# Altium schematic sheet Power.SchDoc
size A4; SheetNumber: 4; SheetTotal: 11
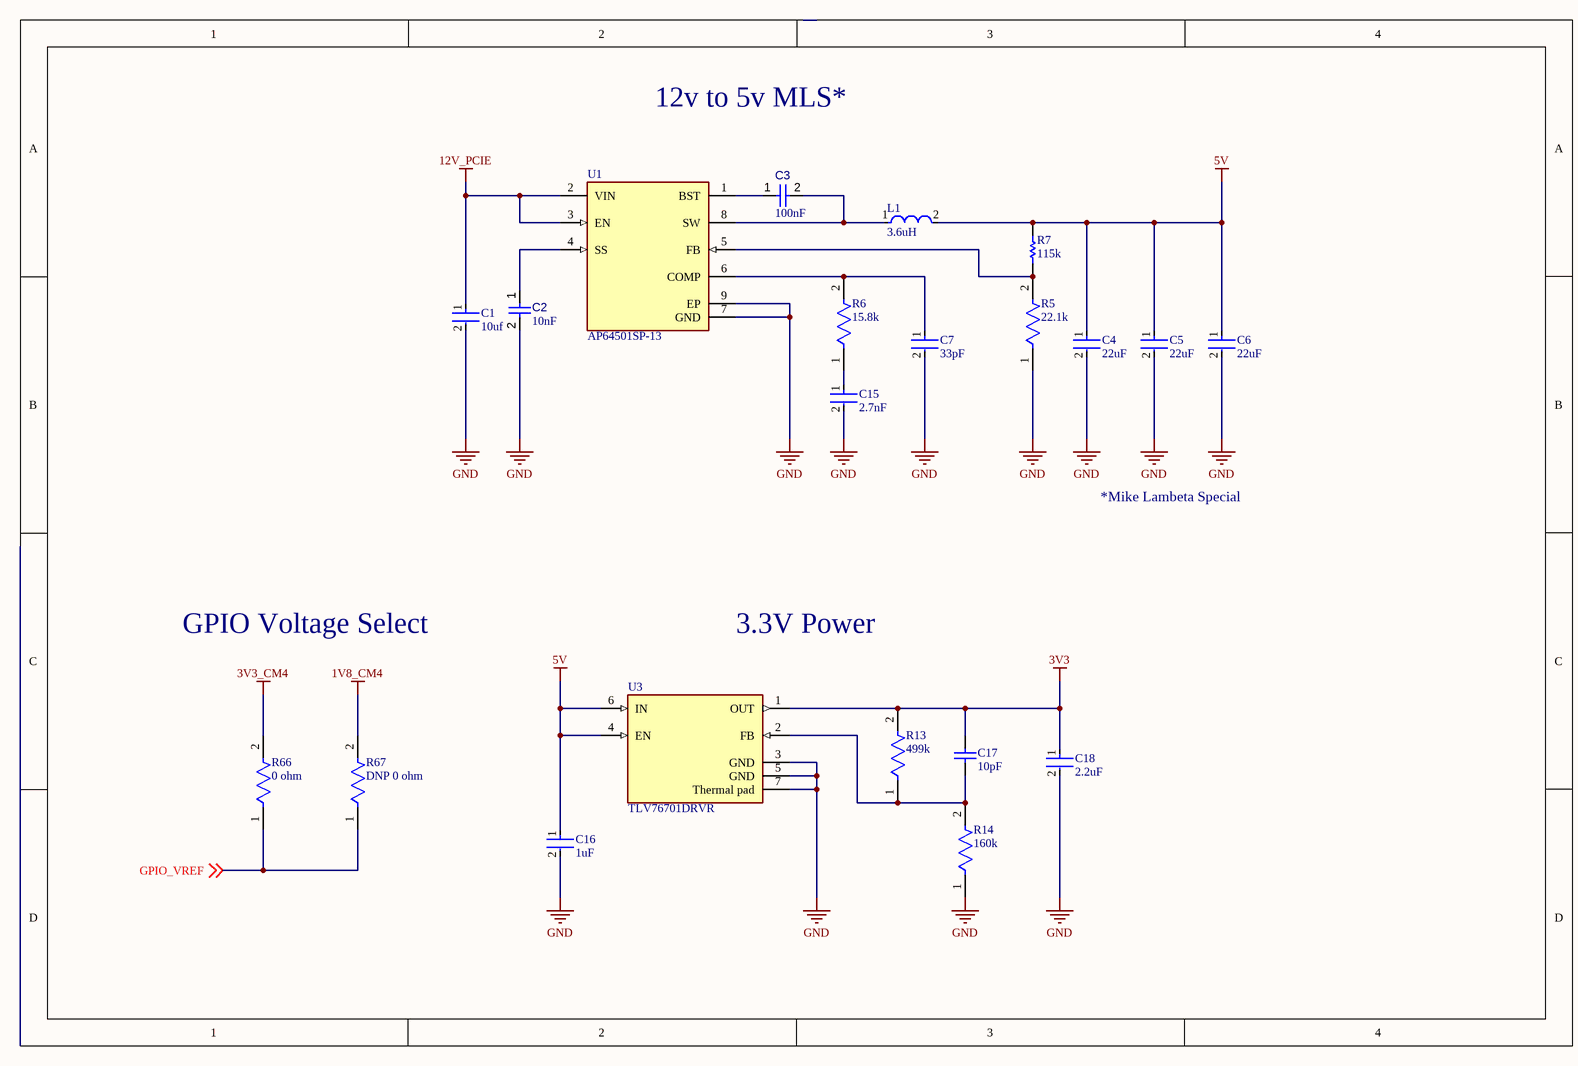
[diagram p0: Power.SchDoc]

## Parts
C1  10uf  [FP-GRM188-0_2-IPC_C]
C2  value 10nF  [CAPC0402(1005)60_L]  (hidden comment: Capacitor 10nF +/-20% 50V 0402)
C3  value 100nF  [CAPC0402(1005)60_L]  (hidden comment: Capacitor 100nF +/-20% 25V 0402)
C4  22uF  [FP-GRM21B-0_15-MFG]
C5  22uF  [FP-GRM21B-0_15-MFG]
C6  22uF  [FP-GRM21B-0_15-MFG]
C7  33pF  [FP-0402-L_1_0_1-W_0_5_0_1-IPC_A]
C15  2.7nF  [FP-CL10-IPC_C]
C16  1uF  [FP-CC0805-0_85-MFG]
C17  10pF  [CAPC1005X55X25ML05T05]
C18  2.2uF  [FP-CC0603-DA-MFG]
L1  3.6uH  [FP-NR8040-H_4_2-MFG]
R5  22.1k  [FP-CRCW0402-e3-IPC_A]
R6  15.8k  [FP-CRCW0402-e3-IPC_C]
R7  115k  [RESC1005X40X25ML05T05]
R13  499k  [FP-CRCW0805-e3-MFG]
R14  160k  [FP-CRCW0805-e3-IPC_C]
R66  0 ohm  [FP-CRCW0603-HPe3-MFG]
R67  DNP 0 ohm  [FP-CRCW0603-HPe3-MFG]
U1  AP64501SP-13  [FP-SO-8EP-IPC_A]
U3  TLV76701DRVR  [FP-DRV0006A-IPC_C]

## Nets
1V8_CM4: R67.2
3V3: C17.2 C18.1 R13.2 U3.1(OUT)
3V3_CM4: R66.2
5V: C4.1 C5.1 C6.1 C16.1 L1.2 R7.2 U3.4(EN) U3.6(IN)
12V_PCIE: C1.1 U1.2(VIN) U1.3(EN)
GND: C1.2 C2.2 C4.2 C5.2 C6.2 C7.2 C15.2 C16.2 C18.2 R5.1 R14.1 U1.7(GND) U1.9(EP) U3.3(GND) U3.5(GND) U3.7(Thermal_pad)
GPIO_VREF: R66.1 R67.1 ; off-sheet GPIO_VREF
NetC2_1: C2.1 U1.4(SS)
NetC3_1: C3.1 U1.1(BST)
NetC3_2: C3.2 L1.1 U1.8(SW)
NetC7_1: C7.1 R6.2 U1.6(COMP)
NetC15_1: C15.1 R6.1
NetC17_1: C17.1 R13.1 R14.2 U3.2(FB)
NetR5_2: R5.2 R7.1 U1.5(FB)

## Notes on the sheet
- 12v to 5v MLS*
- *Mike Lambeta Special
- GPIO Voltage Select
- 3.3V Power

## Library data of the parts
C1 = CMP-06035-045466-1: Chip Multilayer Ceramic Capacitors for General Purpose, 0603, 10uF, X5R, 15%, 20%, 35V; Case Code (Imperial): 0603; Voltage Rating (DC): 35V; Width: 0.031inch; Dielectric: X5R; Voltage Rating: 35V; Min Operating Temperature: -55°C; Thickness: 0.039inch; Mount: Surface Mount; Case/Package: 0603; Length: 0.063inch; Capacitance: 10uF; Max Operating Temperature: 85°C; Packaging: Tape and Reel; Tolerance: 20%; Case Code (Metric): 1608
C2 = CMP-001-00069-3: Chip Capacitor, 10nF +/-20%, 50V, 0402, Thickness 0.6 mm; Tolerance: 5%; Max Operating Temperature: 85°C; Pins: 2; Case/Package: 0402; Voltage Rating: 50V; Min Operating Temperature: -55°C; Mounting Technology: SMT
C3 = CMP-001-00065-4: Chip Capacitor, 100nF +/-20%, 25V, 0402, Thickness 0.6 mm; Tolerance: 10%; Max Operating Temperature: 85°C; Min Operating Temperature: -55°C; Pins: 2; Voltage Rating: 25V; Mounting Technology: SMT; Case/Package: 0402
C4-C6 = CMP-2007-03385-2: Chip Multilayer Ceramic Capacitors for General Purpose, 0805, 22uF, X5R, 15%, 20%, 6.3V; Material: Ceramic; Max Operating Temperature: 85°C; Voltage: 6.3V; Min Operating Temperature: -55°C; Case/Package: 0805; Thickness: 0.053inch; Dielectric: X5R; Packaging: Tape and Reel; Depth: 1.25mm; Termination: SMD/SMT; Voltage Rating (DC): 6.3V; Radiation Hardening: No; Tolerance: 20%; Mount: Surface Mount; Lead Free: Lead Free; Package Quantity: 1; REACH SVHC: No SVHC; Voltage Rating: 6.3V; Capacitance: 22uF; Length: 2mm; Case Code (Imperial): 0805; Case Code (Metric): 2012; Width: 0.049inch; Height: 1.25mm
C7 = CMP-2008-02637-2: General Purpose Ceramic Capacitor, 0402, 33pF, 5%, C0G, 30ppm/°C, 50V; Insulation Resistance: 100GR; REACH SVHC: No SVHC; Radiation Hardening: No; Voltage Rating (DC): 50V; Tolerance: 5%; Voltage Rating: 50V; Mount: Surface Mount; Packaging: Tape and Reel; Construction: Flat; Voltage: 50V; Case/Package: 0402; Temperature Coefficient: 30ppm/°C; Lead Free: Lead Free; Case Code (Metric): 1005; Number of Pins: 2; Min Operating Temperature: -55°C; Capacitance: 33pF; Width: 0.5mm; Dielectric: C0G; Height: 0.5mm; Thickness: 0.022inch; Contact Plating: Tin; Length: 1mm; Package Quantity: 1; Depth: 0.5mm; Termination: SMD/SMT; Max Operating Temperature: 125°C; RoHS Compliant: Yes; Case Code (Imperial): 0402; Series: -
C15 = CMP-13271-000201-1: Cap Ceramic 2.7nF 50V X7R ±10% Pad SMD 0603 +125°C T/R; Thickness: 0.035inch; Capacitance: 2.7nF; Radiation Hardening: No; Height: 0.8mm; Tolerance: 10%; Case Code (Metric): 1608; Voltage: 50V; Voltage Rating: 50V; Package Quantity: 1; Packaging: Tape and Reel; Depth: 0.8mm; Material: Ceramic; Length: 1.6mm; Width: 0.031inch; Case Code (Imperial): 0603; Dielectric: X7R; Max Operating Temperature: 125°C; Case/Package: 0603; Min Operating Temperature: -55°C; Contact Plating: Tin; Mount: Surface Mount
C16 = CMP-03422-000182-1: CAP CER 1UF 10V X7R 0805; Manufacturer: Yageo; Manufacturer Part Number: CC0805KKX7R6BB105; Material: Ceramic; Tolerance: 0.1; Value: 1 uF; ComponentLink2URL: http://www.yageo.com/documents/recent/UPY-GPHC_Y5V_6.3V-to-50V_8.pdf; Automotive: No; Temperature Range Low: -30°C; Octopart: https://octopart.com/cc0805kkx7r6bb105-yageo-42522859; Temperature Characteristic: X7R; RoHS: TRUE; Voltage Rating: 10 V; Capacitance: 1 uF; Package: CC0805-0.85; Device Class L3: Ceramic Capacitors; Category: Cap; Mouser Description: Multilayer Ceramic Capacitors MLCC - SMD/SMT 1.0uF 10V X7R 10%; Temperature Range High: +85°C; Ipc Land Pattern Name: CAPC200125X85; ComponentLink2Description: Datasheet; Temperature: -30°C to +85°C; Height: 0.95mm; Lead Free: Yes; Device Class L1: Passive Components; Device Class L2: Capacitors; Footprint Url: http://www.yageo.com/exep/pages/download/literatures/UPY-C_GEN_24.pdf; Digikey Description: CAP CER 1UF 10V X7R 0805
C17 = CMP-2100-03589-1: Chip Capacitor, 10 pF, +/- 5%, 50 V, -55 to 125 degC, 0402 (1005 Metric), RoHS, Tape and Reel; Manufacturer: Yageo; Insulation Resistance: 100GR; Voltage Rating (DC): 50V; Dielectric Material: Ceramic; Temperature Coefficient: 30ppm/degC; Dielectric: C0G; Termination: SMD/SMT; Package Reference: 0402; Lead Free: LeadFree; Composition: Ceramic; Tolerance: 5%; Case Code (Metric): 1005; Voltage Rating: 50V; Packaging: TapeandReel; Manufacturer URL: http://www.yageo.com/; REACH SVHC: NoSVHC; Max Operating Temperature: 125degC; Length: 1mm; Mount: SurfaceMount; Depth: 0.5mm; Min Operating Temperature: -55degC; Number of Pins: 2; Width: 0.02inch; Datasheet Version: Rev. 14, 07/2016; Package Quantity: 1; Datasheet URL: http://www.yageo.com/documents/recent/UPY-GP_NP0_16V-to-50V_14.pdf; Case Code (Imperial): 0402; RoHSCompliant: True; Radiation Hardening: No; Height: 0.5mm; Case/Package: 0402; Thickness: 0.022inch; Capacitance: 10pF; Package Description: 2-Pin Surface Mount Device, Body 1 x 0.5 mm; Voltage: 50V
C18 = CMP-2000-06073-2: CAP CER 2.2UF 10V X5R 0603; Manufacturer: YAGEO; Manufacturer Part Number: CC0603KRX5R6BB225; Tolerance: 0.1; Temperature Coefficient: 15%; Material: Ceramic; Lead Free: Yes; Temperature: -55°C to +125°C; Category: Cap; Device Class L2: Capacitors; Device Class L3: Ceramic Capacitors; Voltage: 10 V; RoHS: TRUE; Octopart: https://octopart.com/cc0603krx5r6bb225-yageo-8376528; Temperature Characteristic: X5R; Capacitance: 2.2 uF; ComponentLink2URL: http://www.yageo.com/documents/recent/UPY-GPHC_X7R_6.3V-to-50V_18.pdf; Package: CC0603-DA; Footprint Url: http://www.yageo.com/exep/pages/download/literatures/UPY-C_GEN_24.pdf; Device Class L1: Passive Components; Digikey Description: CAP CER 2.2UF 10V X5R 0603; Temperature Range Low: -55°C; ComponentLink2Description: Datasheet; Value: 2.2 uF; Mouser Description: Multilayer Ceramic Capacitors MLCC - SMD/SMT 2.2uF 10V X5R 10%; Temperature Range High: +125°C; Height: 0.9mm; Voltage Rating: 10 V; Automotive: No
L1 = CMP-14484-000604-1: Shielded Wirewound Inductor 3.6uH 30% 6A 19.5mΩ SMD Automotive; DC Resistance (DCR): 19.5mR; Self Resonant Frequency: 34MHz; Core Material: Ferrite; Saturation Current: 6.4A; Test Frequency: 100kHz; Current Rating: 4.9A; Min Operating Temperature: -40°C; Height - Seated (Max): 0.157inch; Shielding: Shielded; Inductance: 3.6uH; Length: 0.315inch; Max Operating Temperature: 125°C; Packaging: Tape and Reel; Width: 0.315inch; Case/Package: Nonstandard; Resistor Type: Wirewound; RoHS Compliant: Yes; Tolerance: 30%; Mount: Surface Mount
R5 = CMP-2002-08380-2: RES Thick Film, 22.1kΩ, 1%, 0.063W, 100ppm/°C, 0402; Voltage Rating: 50V; Resistance: 22.1kR; Power Rating: 63mW; Length: 1mm; Termination: SMD/SMT; Height: 0.35mm; Package Quantity: 10000; Depth: 0.5mm; Lead Free: Lead Free; Packaging: Tape and Reel; Case/Package: 0402; Max Operating Temperature: 155°C; Composition: Thick Film; Min Operating Temperature: -55°C; Working Voltage: 50V; Number of Pins: 2; Contact Plating: Tin; Mount: Surface Mount; Case Code (Imperial): 0402; Temperature Coefficient: 100ppm/°C; Tolerance: 1%; Voltage Rating (DC): 50V; Width: 0.5mm; Number of Terminations: 2; Radiation Hardening: No; Weight: 2.3E-05oz; Military Standard: Not; Case Code (Metric): 1005
R6 = CMP-2002-08223-2: RES Thick Film, 15.8kΩ, 1%, 0.063W, 100ppm/°C, 0402; Resistance: 15.8kR; Voltage Rating: 50V; Max Power Dissipation: 63mW; Contact Plating: Tin; Weight: 2.3E-05oz; Temperature Coefficient: 100ppm/°C; Case Code (Imperial): 0402; Number of Pins: 2; Length: 1mm; Case Code (Metric): 1005; Package Quantity: 10; Termination: SMD/SMT; Number of Terminations: 2; Radiation Hardening: No; Lead Free: Lead Free; Features: Automotive AEC-Q200; Packaging: Tape and Reel; Case/Package: 0402; Voltage Rating (DC): 50V; Max Operating Temperature: 155°C; Depth: 0.5mm; Composition: Thick Film; Tolerance: 1%; Height: 0.016inch; Min Operating Temperature: -55°C; Mount: Surface Mount; Width: 0.02inch; Power Rating: 63mW; Military Standard: Not
R7 = CMP-1011-00742-2: Manufacturer: Panasonic; Part Number: ERJ-2RKF1153X
R13 = CMP-02407-008566-1: RES Thick Film, 499kΩ, 1%, 0.125W, 100ppm/°C, 0805; Max Power Dissipation: 125mW; Voltage Rating: 150V; Resistance: 499kR; Width: 0.049inch; Case Code (Imperial): 0805; Features: Automotive AEC-Q200; Termination: SMD/SMT; Height: 0.02inch; Package Quantity: 10000; Contact Plating: Tin; Temperature Coefficient: 100ppm/°C; Min Operating Temperature: -55°C; Number of Terminations: 2; Packaging: Tape and Reel; Tolerance: 1%; Power Rating: 125mW; Composition: Thick Film; Length: 0.079inch; Case Code (Metric): 2012; Max Operating Temperature: 155°C; Weight: 0.000194oz; Lead Free: Lead Free; Case/Package: 0805; Radiation Hardening: No
R14 = CMP-1013-00757-2: RES Thick Film, 160kΩ, 1%, 0.125W, 100ppm/°C, 0805; Voltage Rating: 150V; Power Rating: 125mW; Resistance: 160kR; Width: 1.25mm; Case/Package: 0805; Package Quantity: 5000; Temperature Coefficient: 100ppm/°C; Length: 2mm; Height: 0.45mm; Weight: 0.000194oz; Mount: Surface Mount; Case Code (Metric): 2012; Min Operating Temperature: -55°C; Termination: SMD/SMT; Case Code (Imperial): 0805; Number of Pins: 2; Packaging: Tape and Reel; Max Operating Temperature: 155°C; Radiation Hardening: No; Military Standard: Not; Depth: 1.25mm; Tolerance: 1%; Composition: Thick Film; Contact Plating: Tin
R66 R67 = CMP-2000-03817-2: RES Thick Film, 0Ω, , 0.33W, , 0603; Max Power Dissipation: 250mW; Voltage Rating (DC): 75V; Temperature Coefficient: 0ppm/°C; Resistance: 0mR; Mount: Surface Mount; Package Quantity: 5000; Features: Automotive AEC-Q200; Length: 1.6mm; Width: 0.033inch; Min Operating Temperature: -55°C; Max Operating Temperature: 155°C; Contact Plating: Tin; Depth: 0.85mm; Case/Package: 0603; Radiation Hardening: No; Military Standard: Not; Power Rating: 250mW; Height: 0.45mm; Composition: Thick Film; Lead Free: Lead Free; Voltage Rating: 75V; Case Code (Imperial): 0603; Weight: 7.1E-05oz; Number of Terminations: 2; Packaging: Tape and Reel; Number of Pins: 2; Case Code (Metric): 1608; Termination: SMD/SMT
U1 = CMP-12757-000024-1: DCDC CONV HV BUCK SO-8EP
U3 = CMP-04917-000172-1: IC REG LINEAR POS ADJ 1A 6WSON